# Altium schematic sheet REF_CPU_STM32_B2.SchDoc
size A4; SheetNumber: 5; SheetTotal: 8
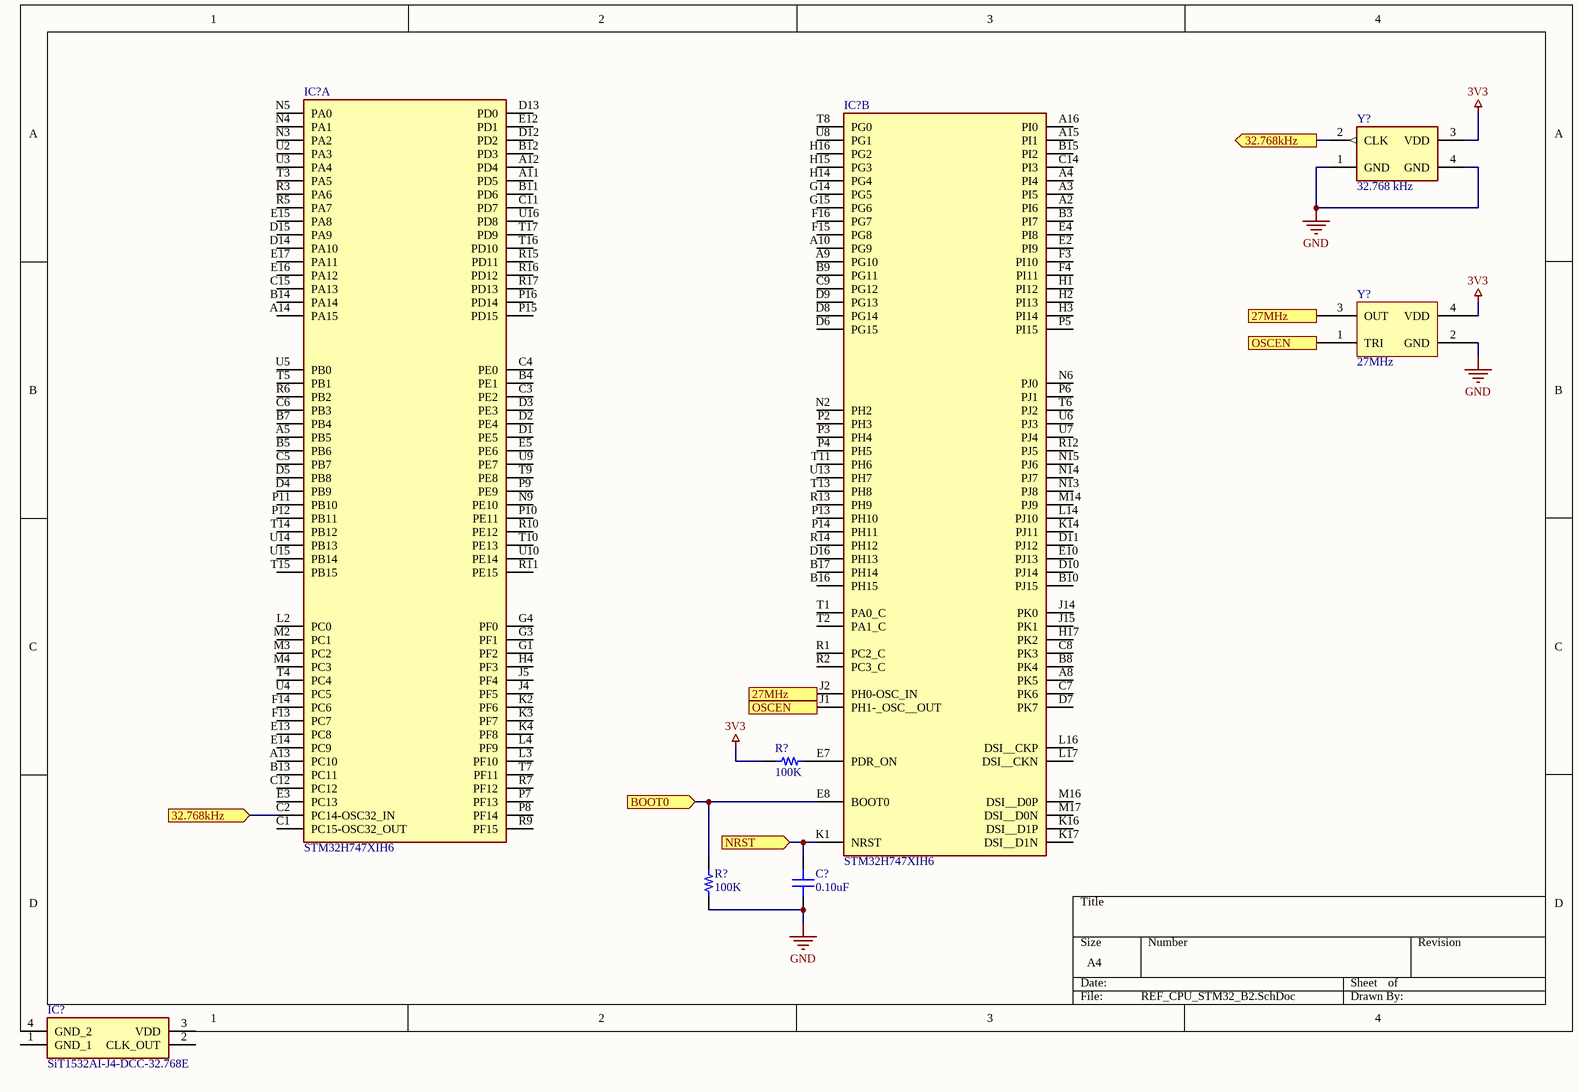
[diagram p0: REF_CPU_STM32_B2.SchDoc]

## Parts
(Parts that share a designator on the sheet are numbered #1, #2 ... from top to bottom, then left to right.)
C?  0.10uF  [CAP 0603/1608]
IC?#1  STM32H747XIH6  [BGA265C80P17X17_1400X1400X110]  (part A of 3)
IC?#2  STM32H747XIH6  [BGA265C80P17X17_1400X1400X110]  (part B of 3)
IC?#3  SiT1532AI-J4-DCC-32.768E  [SiT1532AIJ4DCC32768E]
R?#1  100K  [RES 0603/1608]
R?#2  100K  [RES 0603/1608]
Y?#1  32.768 kHz  [SiT1532AIJ4DCC32768E - duplicate]
Y?#2  27MHz  [ABRACON ASD]

## Ports
27MHz (in), 27MHz (out), 32.768kHz (in), 32.768kHz (out), BOOT0 (in), NRST (in), OSCEN (in), OSCEN (out)

## Nets
3V3: R?#1.1 Y?#1.3(VDD) Y?#2.4(VDD)
GND: C?.1 R?#2.1 Y?#1.1(GND) Y?#1.4(GND) Y?#2.2(GND)
27MHz: IC?#2.J2(PH0-OSC_IN) Y?#2.3(OUT) ; port 27MHz
32.768kHz: IC?#1.C2(PC14-OSC32_IN) Y?#1.2(CLK) ; port 32.768kHz
BOOT0: IC?#2.E8(BOOT0) R?#2.2 ; port BOOT0
NRST: C?.2 IC?#2.K1(NRST) ; port NRST
OSCEN: IC?#2.J1(PH1-_OSC__OUT) Y?#2.1(TRI) ; port OSCEN
NetIC?#2_E7: IC?#2.E7(PDR_ON) R?#1.2

Not connected (* = marked no-connect by the designer): IC?#1 A5(PB5) A11(PD5) A12(PD4) A13(PC10) A14(PA15) B4(PE1) B5(PB6) B7(PB4) B11(PD6) B12(PD3) B13(PC11) B14(PA14) C1(PC15-OSC32_OUT) C3(PE2) C4(PE0) C5(PB7) C6(PB3) C11(PD7) C12(PC12) C15(PA13) D1(PE5) D2(PE4) D3(PE3) D4(PB9) D5(PB8) D12(PD2) D13(PD0) D14(PA10) D15(PA9) E3(PC13) E5(PE6) E12(PD1) E13(PC8) E14(PC9) E15(PA8) E16(PA12) E17(PA11) F13(PC7) F14(PC6) G1(PF2) G3(PF1) G4(PF0) H4(PF3) J4(PF5) J5(PF4) K2(PF6) K3(PF7) K4(PF8) L2(PC0) L3(PF10) L4(PF9) M2(PC1) M3(PC2) M4(PC3) N3(PA2) N4(PA1) N5(PA0) N9(PE10) P7(PF13) P8(PF14) P9(PE9) P10(PE11) P11(PB10) P12(PB11) P15(PD15) P16(PD14) R3(PA6) R5(PA7) R6(PB2) R7(PF12) R9(PF15) R10(PE12) R11(PE15) R15(PD11) R16(PD12) R17(PD13) T3(PA5) T4(PC4) T5(PB1) T7(PF11) T9(PE8) T10(PE13) T14(PB12) T15(PB15) T16(PD10) T17(PD9) U2(PA3) U3(PA4) U4(PC5) U5(PB0) U9(PE7) U10(PE14) U14(PB13) U15(PB14) U16(PD8); IC?#2 A2(PI6) A3(PI5) A4(PI4) A8(PK5) A9(PG10) A10(PG9) A15(PI1) A16(PI0) B3(PI7) B8(PK4) B9(PG11) B10(PJ15) B15(PI2) B16(PH15) B17(PH14) C7(PK6) C8(PK3) C9(PG12) C14(PI3) D6(PG15) D7(PK7) D8(PG14) D9(PG13) D10(PJ14) D11(PJ12) D16(PH13) E2(PI9) E4(PI8) E10(PJ13) F3(PI10) F4(PI11) F15(PG8) F16(PG7) G14(PG5) G15(PG6) H1(PI12) H2(PI13) H3(PI14) H14(PG4) H15(PG3) H16(PG2) H17(PK2) J14(PK0) J15(PK1) K14(PJ11) K16(DSI__D1P) K17(DSI__D1N) L14(PJ10) L16(DSI__CKP) L17(DSI__CKN) M14(PJ9) M16(DSI__D0P) M17(DSI__D0N) N2(PH2) N6(PJ0) N13(PJ8) N14(PJ7) N15(PJ6) P2(PH3) P3(PH4) P4(PH5) P5(PI15) P6(PJ1) P13(PH10) P14(PH11) R1(PC2_C) R2(PC3_C) R12(PJ5) R13(PH9) R14(PH12) T1(PA0_C) T2(PA1_C) T6(PJ2) T8(PG0) T11(PH6) T13(PH8) U6(PJ3) U7(PJ4) U8(PG1) U13(PH7); IC?#3 1(GND_1) 2(CLK_OUT) 3(VDD) 4(GND_2)

## Library data of the parts
C? = CL10A104KA8NNNC: CAP CER 0.1UF 25V X5R 0603; Manufacturer: Samsung Electro-Mechanics America, Inc.; TemperatureRange: -55C ~ 85C; Tolerance: 10%; Value: 0.10uF; Part Number: CL10A104KA8NNNC; PartId: 13476; Supplier 1: Digi-Key; Supplier Part Number 1: 1276-1857-2-ND; ComponentLink1Description: Datasheet; ComponentLink1URL: http://www.samsungsem.com/kr/support/product-search/mlcc/CL10A104KA8NNNC.jsp; ComponentLink2Description: Digi-Key Listing; ComponentLink2URL: https://www.digikey.com/product-detail/en/samsung-electro-mechanics-america-inc/CL10A104KA8NNNC/1276-1857-2-ND/3887515; TemperatureCoefficient: X5R; Voltage: 25V; Price: 0.0069; Device Package: 0603 (1608 Metric)
IC?#1 IC?#2 = STM32H747XIH6: CPU Dual core. • 32-bit Arm® Cortex®-M7; Manufacturer_Name: STMicroelectronics; Datasheet Link: https://www.st.com/en/microcontrollers-microprocessors/stm32h747xi.html; Height: 1.1mm; Manufacturer_Part_Number: STM32H747XIH6; Mouser Part Number: 511-STM32H747XIH6; Mouser Price/Stock: https://www.mouser.co.uk/ProductDetail/STMicroelectronics/STM32H747XIH6?qs=vLWxofP3U2xQGncZcDDLHQ%3D%3D; Arrow Part Number: STM32H747XIH6; Arrow Price/Stock: https://www.arrow.com/en/products/stm32h747xih6/stmicroelectronics?region=nac
IC?#3 = SiT1532AI-J4-DCC-32.768E: Integrated Circuit; Manufacturer_Name: SiTime; Datasheet Link: https://www.sitime.com/datasheet/SiT1532; Height: 0.6mm; Manufacturer_Part_Number: SiT1532AI-J4-DCC-32.768E; Mouser Part Number: 788-1532AIJ4DCC32.76; Mouser Price/Stock: https://www.mouser.co.uk/ProductDetail/SiTime/SiT1532AI-J4-DCC-32768E?qs=hXaRPPpjr%2F31BE%252B6flxGgg%3D%3D; Arrow Part Number: SiT1532AI-J4-DCC-32.768E; Arrow Price/Stock: https://www.arrow.com/en/products/sit1532ai-j4-dcc-32.768e/sitime
R?#1 R?#2 = 0603S8J0104: RES SMD 100K OHM 5% 1/8W 0603; Manufacturer: Uniohm; TemperatureRange: -55C ~ 155C; TemperatureCoefficient: 100ppm/C; PowerRating: 0.125W, 1/8W; Value: 100K; Part Number: 0603S8J0104; Tolerance: 5%; Price: 0.0089; Device Package: 1608 (0603 Metric)
Y?#1 = SiT1532AI: Oscilator 32.768KHz, SiT1532AI-J4-DCC-32.768E
Y?#2 = ASD1-27.000MHZ-EC-T: OSC XO 27.000MHZ CMOS SMD; Manufacturer: Abracon LLC; Frequency Stability: 50ppm; Part Number: ASD1-27.000MHZ-EC-T; PartId: 8938; Supplier 1: Digi-Key; Supplier Part Number 1: 535-9594-2-ND; ComponentLink1Description: Datasheet; ComponentLink1URL: http://www.abracon.com/Oscillators/ASDseries.pdf; ComponentLink2Description: Digi-Key Listing; ComponentLink2URL: https://www.digikey.com/product-detail/en/ASD1-27.000MHZ-EC-T/535-9594-2-ND/1236911; Price: 1.74; Type: XO (Standard); Device Package: 4-SMD, No Lead (DFN, LCC); Series: ASD; Frequency: 27MHz